# Altium schematic sheet BuckConverter.SchDoc
size A4; SheetNumber: 2; SheetTotal: 2
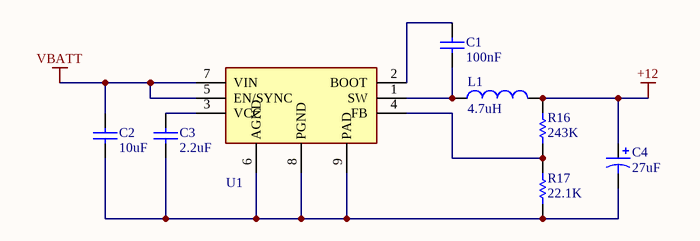
[diagram p0: BuckConverter.SchDoc]

## Parts
C1  value 100nF  [0603 - Capacitor]  (hidden comment: Capacitor - Nonpolarized)
C2  value 10uF  [0603 - Capacitor]  (hidden comment: Capacitor - Nonpolarized)
C3  value 2.2uF  [0603 - Capacitor]  (hidden comment: Capacitor - Nonpolarized)
C4  value 27uF  [OCVZ0606 - CAPACITOR]  (hidden comment: Capacitor - Polarized)
L1  value 4.7uH  [MSS1210 - INDUCTOR]  (hidden comment: Inductor)
R16  value 243K  [0603 - Resistor]  (hidden comment: Resistor)
R17  value 22.1K  [0603 - Resistor]  (hidden comment: Resistor)
U1  LMR23625CDDAR  [LMR23625CDDAR]  (value not drawn)

## Nets
+12: C4.1 L1.2 R16.2
VBATT: C2.2 U1.5(EN/SYNC) U1.7(VIN)
NetC1_1: C1.1 L1.1 U1.1(SW)
NetC1_2: C1.2 U1.2(BOOT)
NetC2_1: C2.1 C3.1 C4.2 R17.1 U1.6(AGND) U1.8(PGND) U1.9(PAD)
NetC3_2: C3.2 U1.3(VCC)
NetR16_1: R16.1 R17.2 U1.4(FB)

## Library data of the parts
C1-C3 = Capacitor - Nonpolarized: Nonpolarized Capacitor; Supplier Part Number: *; Supplier: *; Manufacturer: *; Rating: *; Manufacturer Part Number: *
C4 = Capacitor - Polarized: Polarized Capacitor; Supplier: *; Supplier Part Number: *; Rating: *; Manufacturer: *; Manufacturer Part Number: *
U1 = LMR23625CDDAR: 36V 2.5A Buck Converter; Manufacturer: TI; Manufacturer Part Number: LMR23625CDDAR; Supplier Part Number: 296-47268-1-ND; Supplier: Digikey; ComponentLink1Description: Datasheet; ComponentLink1URL: https://www.ti.com/lit/ds/symlink/lmr23625.pdf?HQS=dis-dk-null-digikeymode-dsf-pf-null-wwe&ts=1623367278580
L1 = Inductor: Rating: *; Manufacturer Part Number: *; Supplier Part Number: *; Supplier: *; Manufacturer: *
R16 R17 = Resistor: Rating: *; Manufacturer Part Number: *; Manufacturer: *; Supplier Part Number: *; Supplier: *